# Altium project Complex_PCB.PrjPcb (part 2 of 3)

## Sheet Microcontroller.SchDoc
size A3; SheetNumber: 3; SheetTotal: 4
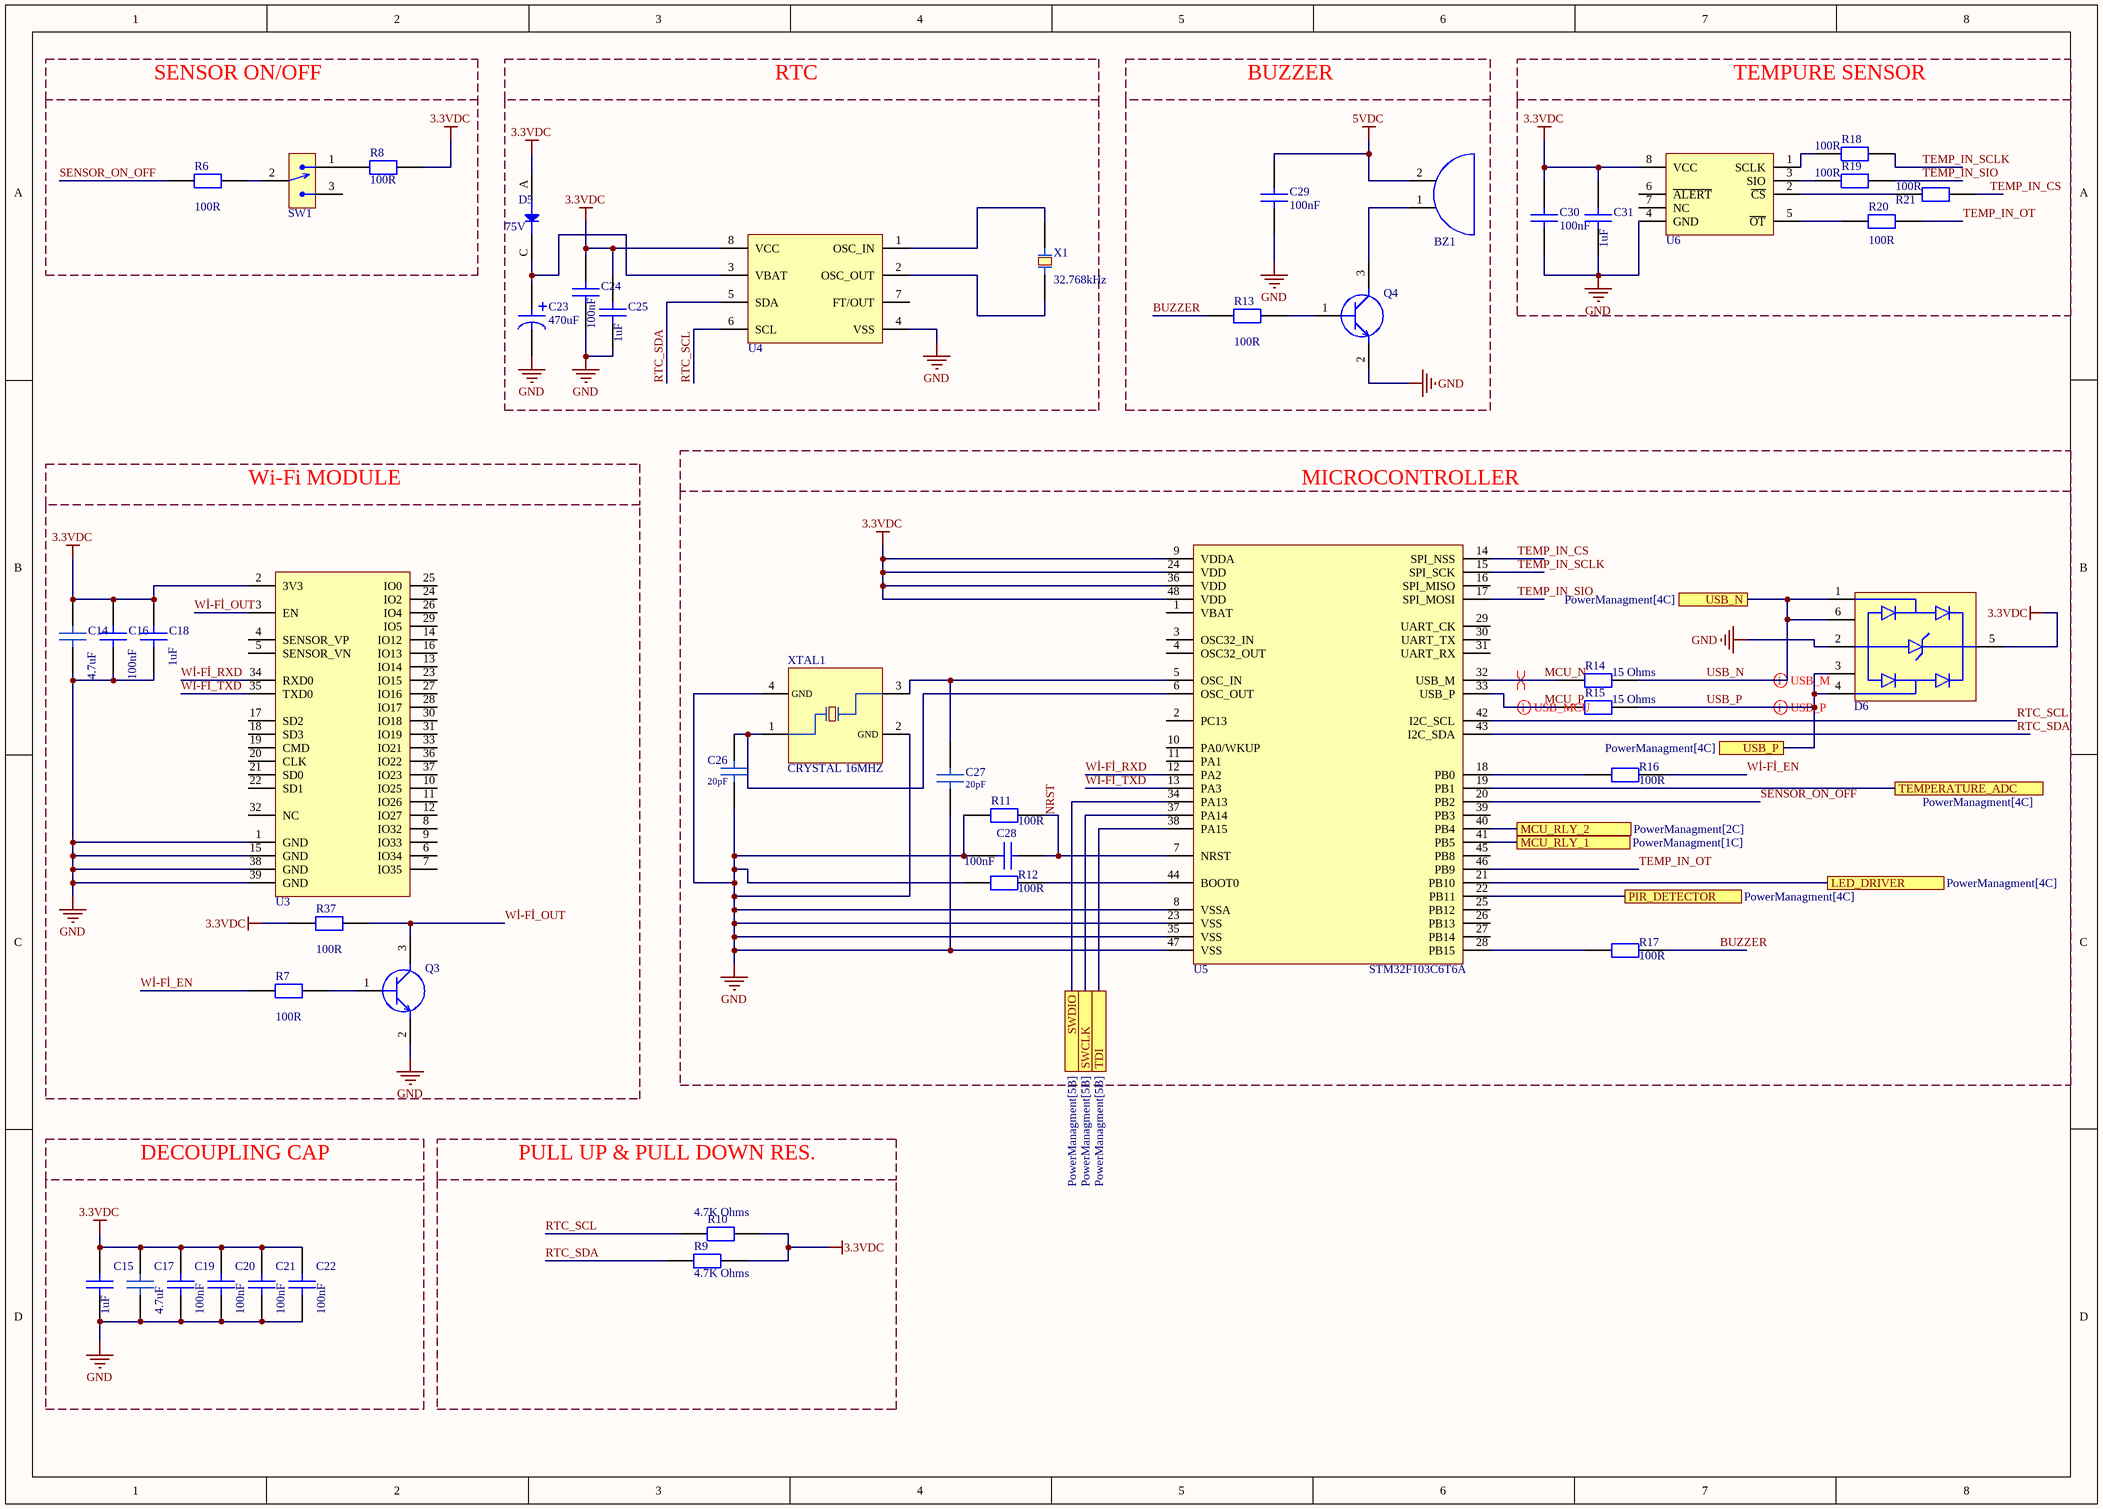
[diagram p2: Microcontroller.SchDoc]

### Parts
BZ1  CMI-9605-0580T  [BUZZER CMI-9605-0580T]  (value not drawn)
C14  value 4.7uF  [CAP 0805]  (hidden comment: CAP CER 4.7UF 25V X5R 0805)
C15  Capacitance: 1uF  [CAP 0805]  (hidden comment: CAP CER 1UF 50V X7R 0805)
C16  Capacitance: 100nF  [CAP 0603]  (hidden comment: CAP CER 100nF)
C17  value 4.7uF  [CAP 0805]  (hidden comment: CAP CER 4.7UF 25V X5R 0805)
C18  Capacitance: 1uF  [CAP 0805]  (hidden comment: CAP CER 1UF 50V X7R 0805)
C19  Capacitance: 100nF  [CAP 0603]  (hidden comment: CAP CER 100nF)
C20  Capacitance: 100nF  [CAP 0603]  (hidden comment: CAP CER 100nF)
C21  Capacitance: 100nF  [CAP 0603]  (hidden comment: CAP CER 100nF)
C22  Capacitance: 100nF  [CAP 0603]  (hidden comment: CAP CER 100nF)
C23  Capacitance: 470uF  [CAP _RADİAL_D10_P5]  (hidden comment: ESH477M050AH4AA CAP)
C24  value 100nF  [CAP 0805]  (hidden comment: CAP CER 0.1UF 50V X7R 0805)
C25  Capacitance: 1uF  [CAP 0805]  (hidden comment: CAP CER 1UF 50V X7R 0805)
C26  Capacitance: 20pF  [CAP 0603]  (hidden comment: CAP CER 20PF 50V C0G/NP0 0603)
C27  Capacitance: 20pF  [CAP 0603]  (hidden comment: CAP CER 20PF 50V C0G/NP0 0603)
C28  Capacitance: 100nF  [CAP 0603]  (hidden comment: CAP CER 100nF)
C29  value 100nF  [CAP 0805]  (hidden comment: CAP CER 0.1UF 50V X7R 0805)
C30  Capacitance: 100nF  [CAP 0603]  (hidden comment: CAP CER 100nF)
C31  Capacitance: 1uF  [CAP 0805]  (hidden comment: CAP CER 1UF 50V X7R 0805)
D5  Operating Voltage: 75V  [SOD323F]  (hidden comment: DIODE GEN PURP 75V 150MA SOD323F)
D6  TVS DIODE 5.25VWM 17VC SOT23-6  [SOT23-6L]  (value not drawn)
Q3  MMBT3904-7-F  [SOT23F]  (value not drawn)
Q4  MMBT3904-7-F  [SOT23F]  (value not drawn)
R6  Resistance: 100R  [RES 0603]  (hidden comment: RC0603JR-07100RL)
R7  Resistance: 100R  [RES 0603]  (hidden comment: RC0603JR-07100RL)
R8  Resistance: 100R  [RES 0603]  (hidden comment: RC0603JR-07100RL)
R9  Resistance: 4.7K Ohms  [RES 0603]  (hidden comment: RC0603JR-074K7L)
R10  Resistance: 4.7K Ohms  [RES 0603]  (hidden comment: RC0603JR-074K7L)
R11  Resistance: 100R  [RES 0603]  (hidden comment: RC0603JR-07100RL)
R12  Resistance: 100R  [RES 0603]  (hidden comment: RC0603JR-07100RL)
R13  Resistance: 100R  [RES 0603]  (hidden comment: RC0603JR-07100RL)
R14  Resistance: 15 Ohms  [RES 0603]  (hidden comment: RC0603JR-0715RL)
R15  Resistance: 15 Ohms  [RES 0603]  (hidden comment: RC0603JR-0715RL)
R16  Resistance: 100R  [RES 0603]  (hidden comment: RC0603JR-07100RL)
R17  Resistance: 100R  [RES 0603]  (hidden comment: RC0603JR-07100RL)
R18  Resistance: 100R  [RES 0603]  (hidden comment: RC0603JR-07100RL)
R19  Resistance: 100R  [RES 0603]  (hidden comment: RC0603JR-07100RL)
R20  Resistance: 100R  [RES 0603]  (hidden comment: RC0603JR-07100RL)
R21  Resistance: 100R  [RES 0603]  (hidden comment: RC0603JR-07100RL)
R37  Resistance: 100R  [RES 0603]  (hidden comment: RC0603JR-07100RL)
SW1  EG1215AA  [EG1215AA]  (value not drawn)
U3  ESP32-VROOM-32  [ESP-32-32E]  (value not drawn)
U4  M41T00M6F  [SOIC8]  (value not drawn)
U5  STM32F103C6T6A  [LQFP48]
U6  MAX6662MSA+  [SOIC8]  (value not drawn)
X1  Frequency: 32.768kHz  [ABS05]  (hidden comment: CRYSTAL 32.7680KHZ 12.5PF SMD)
XTAL1  CRYSTAL 16MHZ  [ECS-160-20-30B-TR]

### Blocks framed on the sheet
SENSOR ON/OFF: R6 R8 SW1
RTC: C23-C25 D5 U4 X1
BUZZER: BZ1 C29 Q4 R13
TEMPURE SENSOR: C30 C31 R18-R21 U6
MICROCONTROLLER: C26-C28 D6 R11 R12 R14-R17 U5 XTAL1
Wi-Fi MODULE: C14 C16 C18 Q3 R7 R37 U3
DECOUPLING CAP: C15 C17 C19-C22
PULL UP & PULL DOWN RES.: R9 R10

### Ports
LED_DRIVER (see PowerManagment[4C]), MCU_RLY_1 (see PowerManagment[1C]), MCU_RLY_2 (see PowerManagment[2C]), PIR_DETECTOR (see PowerManagment[4C]), SWCLK (see PowerManagment[5B]), SWDIO (see PowerManagment[5B]), TDI (see PowerManagment[5B]), TEMPERATURE_ADC (see PowerManagment[4C]), USB_N (see PowerManagment[4C]), USB_P (see PowerManagment[4C])

### Nets
3.3VDC: C14.2 C15.1 C16.2 C17.2 C18.1 C19.2 C20.2 C21.2 C22.2 C24.2 C25.1 C30.2 C31.1 D5.A(Anode) D6.5(VBUS) R8.2 R9.2 R10.2 R37.1 U3.2(3V3) U4.8(VCC) U5.9(VDDA) U5.24(VDD) U5.36(VDD) U5.48(VDD) U6.8(VCC)
5VDC: BZ1.2 C29.2
GND: C14.1 C15.2 C16.1 C17.1 C18.2 C19.1 C20.1 C21.1 C22.1 C23.2 C24.1 C25.2 C26.1 C27.1 C28.1 C29.1 C30.1 C31.2 D6.2(GND) Q3.2(EMİTTER) Q4.2(EMİTTER) R11.1 R12.1 U3.1(GND) U3.15(GND) U3.38(GND) U3.39(GND) U4.4(VSS) U5.8(VSSA) U5.23(VSS) U5.35(VSS) U5.47(VSS) U6.4(GND) XTAL1.2(GND) XTAL1.4(GND)
BUZZER: R13.1 R17.2
MCU_N: R14.2 U5.32(USB_M)
MCU_P: R15.2 U5.33(USB_P)
NRST: C28.2 R11.2 U5.7(NRST)
RTC_SCL: R10.1 U4.6(SCL) U5.42(I2C_SCL)
RTC_SDA: R9.1 U4.5(SDA) U5.43(I2C_SDA)
SENSOR_ON_OFF: R6.1 U5.20(PB2)
TEMP_IN_CS: R21.2 U5.14(SPI_NSS)
TEMP_IN_OT: R20.2 U5.46(PB9)
TEMP_IN_SCLK: R18.2 U5.15(SPI_SCK)
TEMP_IN_SIO: R19.2 U5.17(SPI_MOSI)
USB_N: D6.1(I/O1) D6.6(I/O1) R14.1 ; port USB_N
USB_P: D6.3(I/O2) D6.4(I/O2) R15.1 ; port USB_P
Wİ-Fİ_EN: R7.1 R16.2
Wİ-Fİ_OUT: Q3.3(CONNECTOR) R37.2 U3.3(EN)
Wİ-Fİ_RXD: U3.34(RXD0) U5.12(PA2)
Wİ-Fİ_TXD: U3.35(TXD0) U5.13(PA3)
NetBZ1_1: BZ1.1 Q4.3(CONNECTOR)
NetC23_1: C23.1 D5.C(Cathode) U4.3(VBAT)
NetC26_2: C26.2 U5.6(OSC_OUT) XTAL1.1(IN/OUT)
NetC27_2: C27.2 U5.5(OSC_IN) XTAL1.3(OUT/IN)
NetJ6_2: U5.21(PB10) ; port LED_DRIVER
NetJ6_3: U5.19(PB1) ; port TEMPERATURE_ADC
NetJ6_4: U5.22(PB11) ; port PIR_DETECTOR
NetJ7_2: U5.38(PA15) ; port TDI
NetJ7_3: U5.37(PA14) ; port SWCLK
NetJ7_4: U5.34(PA13) ; port SWDIO
NetQ3_1: Q3.1(BASE) R7.2
NetQ4_1: Q4.1(BASE) R13.2
NetR1_1: U5.41(PB5) ; port MCU_RLY_1
NetR4_1: U5.40(PB4) ; port MCU_RLY_2
NetR6_2: R6.2 SW1.2
NetR8_1: R8.1 SW1.1
NetR12_2: R12.2 U5.44(BOOT0)
NetR16_1: R16.1 U5.18(PB0)
NetR17_1: R17.1 U5.28(PB15)
NetR18_1: R18.1 U6.1(SCLK)
NetR19_1: R19.1 U6.3(SIO)
NetR20_1: R20.1 U6.5(~{OT})
NetR21_1: R21.1 U6.2(~{CS})
NetU4_1: U4.1(OSC_IN) X1.1
NetU4_2: U4.2(OSC_OUT) X1.2

Not connected (* = marked no-connect by the designer): SW1 3; U3 4(SENSOR_VP) 5(SENSOR_VN) 6(IO34) 7(IO35) 8(IO32) 9(IO33) 10(IO25) 11(IO26) 12(IO27) 13(IO14) 14(IO12) 16(IO13) 17(SD2) 18(SD3) 19(CMD) 20(CLK) 21(SD0) 22(SD1) 23(IO15) 24(IO2) 25(IO0) 26(IO4) 27(IO16) 28(IO17) 29(IO5) 30(IO18) 31(IO19) 32(NC) 33(IO21) 36(IO22) 37(IO23); U4 7(FT/OUT); U5 1(VBAT) 2(PC13) 3(OSC32_IN) 4(OSC32_OUT) 10(PA0/WKUP) 11(PA1) 16(SPI_MISO) 25(PB12) 26(PB13) 27(PB14) 29(UART_CK) 30(UART_TX) 31(UART_RX) 39(PB3) 45(PB8); U6 6(~{ALERT}) 7(NC)

### Layout directives
differential pair: MCU_N, MCU_P, USB_N, USB_P

### Library data of the parts
BZ1 = CMI-9605-0580T: 9.6 mm, 5 Vdc, 80 dB, Through Hole, Driving Circuit, Magnetic Audio Indicator Buzzer; Manufacturer: CUI Devices; Supply Voltage Nominal: 3 ~ 7V; Designed By: Görkem Bulut; Supplier: Digi-Key; Supplier Part Number: 102-CMI-9605-0580T-ND; Manufacturer Part Number: CMI-9605-0580T; RoHS: No; Operating Temperature: -30°C ~ 70°C; Case Package: CMI-9605IC
C14 C17 = CAP CER 4.7uF: Manufacturer: Samsung; Manufacturer Part Number: CL21A475KAQNNNE; Tolerance: 10%; Supplier: Digi-Key; Supplier Part Number: 1276-1244-1-ND; RoHS: Yes; Category: Ceramic Capacitors; Stock: 3937628; Pricing: 1=0,1, 10=0,073, 50=0,0414, 100=0,0344, 500=0,02408, 1000=0,01994 (USD); Mounting Technology: Surface Mount; Case/Package: 0805; Case Code (Metric): 2012; Case Code (Imperial): 0805; Min Operating Temperature: -55°C; Max Operating Temperature: 85°C; Packaging: Tape and Reel; Voltage Rating: 25V; Dielectric: X5R; Voltage Rating (DC): 25V; Series: CL; Construction: Flat; Length: 2mm; Height: 1.25mm; Depth: 1.25mm; Radiation Hardening: No; Lead Free: Lead Free; RoHS Compliant: Yes; ComponentLink1URL: https://datasheet.ciiva.com/25798/cl21a475kaqnnne-25798882.pdf?src-supplier=Digi-Key; ComponentLink1Description: https://datasheet.ciiva.com/25798/cl21a475kaqnnne-25798882.pdf?src-supplier=Digi-Key
C15 C18 C25 C31 = CAP CER 1uF: Manufacturer: Samsung; Manufacturer Part Number: CL21B105KBFNNNE; Designed By: Görkem Bulut; Supplier: Digi-Key; Supplier Part Number: 1276-1029-1-ND; RoHS: Yes; Category: Ceramic Capacitors; Stock: 142606; Pricing: 1=0,11, 10=0,079, 50=0,045, 100=0,0373, 500=0,02616, 1000=0,02165 (USD); ComponentLink1URL: https://datasheet.ciiva.com/16449/cl21b105kbfnnne-16449003.pdf?src-supplier=Future+Electronics; ComponentLink1Description: https://datasheet.ciiva.com/16449/cl21b105kbfnnne-16449003.pdf?src-supplier=Future+Electronics; ComponentLink2URL: https://datasheet.ciiva.com/25800/cl21b105kbfnnne-25800291.pdf?src-supplier=Digi-Key; ComponentLink2Description: https://datasheet.ciiva.com/25800/cl21b105kbfnnne-25800291.pdf?src-supplier=Digi-Key; Case Package: 0805
C16 C19-C22 C28 C30 = CAP CER 100nF: Cap Cer 0.1UF 16V X7R 0603 %10; Manufacturer: KEMET; Manufacturer Part Number: C0603C104K4RAC7082; Designed by: Görkem Bulut; Number of Pads: 2; Supplier: Digi-Key; Supplier Part Number: 399-C0603C104K4RAC7082CT-ND; RoHS: Yes; Category: Ceramic Capacitors; Stock: 34170; Pricing: 1=0,1, 10=0,072, 50=0,0394, 100=0,0322, 500=0,02298, 1000=0,01805, 2500=0,01641, 5000=0,0151 (USD); RoHS Compliant: Yes; Case Package: 0603
C23 = ESH477M050AH4AA CAP: Cap, 470UF, 50V, Alu Elec, Radial; Manufacturer: KEMET; Designed By: Görkem Bulut; Supplier: Digi-Key; Supplier Part Number: 399-15683-ND; Manufacturer Part Number: ESH477M050AH4AA; RoHS: Yes; Stock: 6719; Pricing: 1=0,68, 10=0,482, 50=0,3646, 100=0,3175, 500=0,23518, 1000=0,19991, 2500=0,18815, 5000=0,17639 (USD); ComponentLink1URL: https://api.kemet.com/component-edge/download/datasheet/ESH477M050AH4AA.pdf?src-supplier=Digi-Key; ComponentLink1Description: https://api.kemet.com/component-edge/download/datasheet/ESH477M050AH4AA.pdf?src-supplier=Digi-Key; ComponentLink2URL: https://datasheet.octopart.com/ESH477M050AH4AA-KEMET-datasheet-130075338.pdf?src-supplier=Newark; ComponentLink2Description: https://datasheet.octopart.com/ESH477M050AH4AA-KEMET-datasheet-130075338.pdf?src-supplier=Newark
C24 C29 = CAP CER 100nF 0805: Multilayer Ceramic Capacitor, 0.1 uF, 50 V, ± 10%, X7R, 0805 [2012 Metric]; Manufacturer: Samsung; Manufacturer Part Number: CL21B104KBCNNNC; Supplier: Digi-Key; Supplier Part Number: 1276-1003-1-ND; RoHS: Yes; Category: Ceramic Capacitors; Stock: 954560; Pricing: 1=0,1, 10=0,044, 50=0,024, 100=0,0196, 500=0,01404, 1000=0,01103 (USD); Mounting Technology: Surface Mount; Case/Package: 0805; Case Code (Metric): 2012; Case Code (Imperial): 0805; Material: Ceramic; Min Operating Temperature: -55°C; Max Operating Temperature: 125°C; Tolerance: 10%; Dielectric: X7R; Packaging: Tape and Reel; Voltage Rating: 50V; Voltage: 50V; Voltage Rating (DC): 50V; Series: CL; Construction: Flat; Length: 2mm; Width: 0.049inch; Height: 0.85mm; Depth: 1.25mm; Thickness: 0.037inch; Radiation Hardening: No; Lead Free: Lead Free; RoHS Compliant: Yes; ComponentLink1URL: https://datasheet.ciiva.com/25710/cl21b104kbcnnnc-25710182.pdf?src-supplier=Digi-Key; ComponentLink1Description: https://datasheet.ciiva.com/25710/cl21b104kbcnnnc-25710182.pdf?src-supplier=Digi-Key; ComponentLink2URL: https://datasheet.ciiva.com/29199/454152-da-01-en-vs-kondensator-0805-29199814.pdf?src-supplier=Conrad; ComponentLink2Description: https://datasheet.ciiva.com/29199/454152-da-01-en-vs-kondensator-0805-29199814.pdf?src-supplier=Conrad
C26 C27 = CAP CER 20pF: Manufacturer: Samsung; Manufacturer Part Number: CL10C200JB8NNNC; Supplier: Digi-Key; Supplier Part Number: 1276-1187-1-ND; RoHS: Yes; Category: Ceramic Capacitors; Stock: 417304; Pricing: 1=0,1, 10=0,044, 50=0,0238, 100=0,0194, 500=0,01386, 1000=0,01089 (USD); ComponentLink1URL: https://datasheet.ciiva.com/26877/getdatasheetpartid-640634-26877974.pdf?src-supplier=Verical; ComponentLink1Description: https://datasheet.ciiva.com/26877/getdatasheetpartid-640634-26877974.pdf?src-supplier=Verical; ComponentLink2URL: https://datasheet.ciiva.com/26310/mlcc-catalogdownload2013-eng-26310315.pdf?src-supplier=Distrelec; ComponentLink2Description: https://datasheet.ciiva.com/26310/mlcc-catalogdownload2013-eng-26310315.pdf?src-supplier=Distrelec; Case/Package: 0603
D5 = 1N4148WS: VR=75V IF=150mA Trr=4ns P=200mW; Manufacturer: ON Semiconductor / Fairchild; Designed By: Görkem Bulut; Supplier: Digi-Key; Supplier Part Number: 1N4148WSFSCT-ND; Manufacturer Part Number: 1N4148WS; RoHS: Yes; Category: Rectifier Diodes; Stock: 1572050; Pricing: 1=0,18, 10=0,169, 100=0,0918, 500=0,0565, 1000=0,03852 (USD); ComponentLink1URL: https://datasheet.ciiva.com/15208/getdatasheetpartid-127819-15208358.pdf?src-supplier=Verical; ComponentLink1Description: https://datasheet.ciiva.com/15208/getdatasheetpartid-127819-15208358.pdf?src-supplier=Verical; Case Package: SOD323F; Operatşng Current: 150mA
D6 = USBLC6-2SC6: Manufacturer: STMicroelectronics; Designed By: Görkem Bulut; Supplier: Digi-Key; Supplier Part Number: 497-5235-1-ND; Manufacturer Part Number: USBLC6-2SC6; RoHS: Yes; Category: TVS Diodes; Stock: 135257; Pricing: 1=0,6, 10=0,512, 100=0,3823, 500=0,30042, 1000=0,23214 (USD); ComponentLink1URL: https://datasheet.ciiva.com/15143/getdatasheetpartid-148465-15143789.pdf?src-supplier=Verical; ComponentLink1Description: https://datasheet.ciiva.com/15143/getdatasheetpartid-148465-15143789.pdf?src-supplier=Verical; ComponentLink2URL: https://datasheet.ciiva.com/1268/1690354-1268384.pdf?src-supplier=Element14; ComponentLink2Description: https://datasheet.ciiva.com/1268/1690354-1268384.pdf?src-supplier=Element14; ComponentLink3URL: https://datasheet.ciiva.com/4508/cd00050750-113117-4508433.pdf?src-supplier=Mouser; ComponentLink3Description: https://datasheet.ciiva.com/4508/cd00050750-113117-4508433.pdf?src-supplier=Mouser; ComponentLink4URL: https://datasheet.ciiva.com/16200/cd00050750-16200026.pdf?src-supplier=Future+Electronics; ComponentLink4Description: https://datasheet.ciiva.com/16200/cd00050750-16200026.pdf?src-supplier=Future+Electronics; ComponentLink5URL: https://datasheet.ciiva.com/41444/001184109-da-01-en-ic-esd-protecti-usblc6-2sc6-sot-23-6-stm-41444156.pdf?src-supplier=Conrad; ComponentLink5Description: https://datasheet.ciiva.com/41444/001184109-da-01-en-ic-esd-protecti-usblc6-2sc6-sot-23-6-stm-41444156.pdf?src-supplier=Conrad; Case Package: SOT23-6L
Q3 Q4 = MMBT3904-7-F: Transistor General Purpose BJT NPN 40 Volt 0.2A Automotive 3-Pin SOT-23; Manufacturer: Diodes Zetex; Designed by: Gökem Bulut; Max Power Dissipation: 300mW; Collector Emitter Voltage (VCEO): 40V; Max Collector Current: 200mA; Collector Base Voltage (VCBO): 60V; Power Dissipation: 350mW; Frequency: 300MHz; hFE Min: 100; Number of Elements: 1; Emitter Base Voltage (VEBO): 6V; Collector Emitter Saturation Voltage: 300mV; Supplier: Digi-Key; Supplier Part Number: MMBT3904-FDICT-ND; Manufacturer Part Number: MMBT3904-7-F; RoHS: Yes; Category: BJTs; Stock: 6151063; Pricing: 1=0,12, 10=0,111, 100=0,0607, 500=0,03732, 1000=0,02545 (USD); Mounting Technology: Surface Mount; Case/Package: SOT-23; Pins: 3; Weight: 0.000282oz; Min Operating Temperature: -55°C; Max Operating Temperature: 150°C; Polarity: NPN; Packaging: Tape and Reel; Package Quantity: 3000; Transition Frequency: 300MHz; Collector Emitter Breakdown Voltage: 40V; Max Breakdown Voltage: 40V; Continuous Collector Current: 200mA; Clock Frequency: 300MHz; Gain Bandwidth Product: 300MHz; Voltage Rating (DC): 40V; Series: Automotive, AEC-Q101; Collector-emitter Voltage-Max: 300mV; Length: 3.05mm; Width: 1.4mm; Height: 1mm; Radiation Hardening: No; Reach SVHC Compliant: No; Lead Free: Lead Free; RoHS Compliant: Yes; ComponentLink1URL: https://datasheet.ciiva.com/11201/ds30036-11201778.pdf?src-supplier=Avnet; ComponentLink1Description: https://datasheet.ciiva.com/11201/ds30036-11201778.pdf?src-supplier=Avnet; ComponentLink2URL: https://datasheet.ciiva.com/15138/getdatasheetpartid-53265-15138780.pdf?src-supplier=Verical; ComponentLink2Description: https://datasheet.ciiva.com/15138/getdatasheetpartid-53265-15138780.pdf?src-supplier=Verical; ComponentLink3URL: https://datasheet.ciiva.com/22711/1915516-22711750.pdf?src-supplier=Element14; ComponentLink3Description: https://datasheet.ciiva.com/22711/1915516-22711750.pdf?src-supplier=Element14; ComponentLink4URL: https://datasheet.ciiva.com/11198/ds30036-11198999.pdf?src-supplier=Avnet; ComponentLink4Description: https://datasheet.ciiva.com/11198/ds30036-11198999.pdf?src-supplier=Avnet; ComponentLink5URL: https://datasheet.ciiva.com/6361/ds30036-6361256.pdf?src-supplier=Digi-Key; ComponentLink5Description: https://datasheet.ciiva.com/6361/ds30036-6361256.pdf?src-supplier=Digi-Key; ComponentLink6URL: https://datasheet.ciiva.com/6361/ds30036-6361254.pdf?src-supplier=Digi-Key; ComponentLink6Description: https://datasheet.ciiva.com/6361/ds30036-6361254.pdf?src-supplier=Digi-Key
R6-R8 R11-R13 R16-R21 R37 = RES 100 OHM: Res Thick Film 0603 100 Ohm 5% 1/10W ±100ppm/°C Molded SMD SMD Paper T/R; Manufacturer: Yageo; Voltage Rating (DC): 50V; Power Rating: 100mW; Designed By: G.B; Supplier: Digi-Key; Supplier Part Number: 311-100GRCT-ND; Manufacturer Part Number: RC0603JR-07100RL; RoHS: Yes; Category: Chip SMD Resistors; Stock: 983038; Pricing: 1=0,1, 10=0,014, 50=0,0088, 100=0,0073, 500=0,00486, 1000=0,00415 (USD); Case/Package: 0603; Pins: 2; Contact Plating: Tin,Matte; Case Code (Imperial): 0603; Case Code (Metric): 1608; Min Operating Temperature: -55°C; Max Operating Temperature: 155°C; Tolerance: 5%; Temperature Coefficient: 100ppm/°C; Resistor Type: Thick Film; Packaging: Tape and Reel; Voltage Rating: 50V; Termination: SMD/SMT; Features: Moisture Resistant; Series: RC; Max Power Dissipation: 100mW; Number of Terminations: 2; Construction: Rectangular; Resistance Tolerance: 5%; Length: 1.6mm; Width: 0.8mm; Depth: 0.8mm; Lead Free: Lead Free; Reach SVHC Compliant: Unknown; Military Standard: Not; RoHS Compliant: Yes; ComponentLink1URL: https://datasheet.ciiva.com/7746/443971-7746425.pdf?src-supplier=Element14; ComponentLink1Description: https://datasheet.ciiva.com/7746/443971-7746425.pdf?src-supplier=Element14; ComponentLink2URL: https://datasheet.ciiva.com/7746/443971-7746426.pdf?src-supplier=Element14; ComponentLink2Description: https://datasheet.ciiva.com/7746/443971-7746426.pdf?src-supplier=Element14; ComponentLink3URL: https://datasheet.ciiva.com/8883/pyu-rc0603-51-rohs-l-4-8883047.pdf?src-supplier=Avnet; ComponentLink3Description: https://datasheet.ciiva.com/8883/pyu-rc0603-51-rohs-l-4-8883047.pdf?src-supplier=Avnet; ComponentLink4URL: https://datasheet.ciiva.com/15189/getdatasheetpartid-325207-15189846.pdf?src-supplier=Verical; ComponentLink4Description: https://datasheet.ciiva.com/15189/getdatasheetpartid-325207-15189846.pdf?src-supplier=Verical
R9 R10 = RES 4K7 OHM: Res General Purpose Thick Film 0603 4.7k Ohm 5% 1/10W ±100ppm/°C Molded Paper T/R; Manufacturer: Yageo; Case Pakcage: 0603; Designed By: Görkem Bulut; Supplier: Digi-Key; Supplier Part Number: 311-4.7KGRCT-ND; Manufacturer Part Number: RC0603JR-074K7L; RoHS: Yes; Category: Chip SMD Resistors; Stock: 7163965; Pricing: 1=0,1, 10=0,014, 50=0,0088, 100=0,0073, 500=0,00486, 1000=0,00415 (USD); ComponentLink1URL: https://datasheet.ciiva.com/46412/443971-46412858.pdf?src-supplier=Element14; ComponentLink1Description: https://datasheet.ciiva.com/46412/443971-46412858.pdf?src-supplier=Element14
R14 R15 = RES 15 OHM: Res Thick Film 0603 15 Ohm 5% 0.1W(1/10W) ±100ppm/C Pad SMD T/R; Manufacturer: Yageo; Designed By: Görkem Bulut; Supplier: Digi-Key; Supplier Part Number: 311-15GRCT-ND; Manufacturer Part Number: RC0603JR-0715RL; RoHS: Yes; Category: Chip SMD Resistors; Stock: 976030; Pricing: 1=0,1, 10=0,014, 50=0,0088, 100=0,0073, 500=0,00486, 1000=0,00415 (USD); ComponentLink1URL: https://datasheet.ciiva.com/2453/pyu-r-int-thick-7-2453085.pdf?src-supplier=Digi-Key; ComponentLink1Description: https://datasheet.ciiva.com/2453/pyu-r-int-thick-7-2453085.pdf?src-supplier=Digi-Key; ComponentLink2URL: https://datasheet.ciiva.com/2453/pyu-r-int-thick-7-2453086.pdf?src-supplier=Digi-Key; ComponentLink2Description: https://datasheet.ciiva.com/2453/pyu-r-int-thick-7-2453086.pdf?src-supplier=Digi-Key; ComponentLink3URL: https://datasheet.ciiva.com/2453/pyu-r-int-thick-7-2453087.pdf?src-supplier=Digi-Key; ComponentLink3Description: https://datasheet.ciiva.com/2453/pyu-r-int-thick-7-2453087.pdf?src-supplier=Digi-Key; ComponentLink4URL: https://datasheet.ciiva.com/7746/443971-7746445.pdf?src-supplier=Element14; ComponentLink4Description: https://datasheet.ciiva.com/7746/443971-7746445.pdf?src-supplier=Element14; ComponentLink5URL: https://datasheet.ciiva.com/7746/443971-7746446.pdf?src-supplier=Element14; ComponentLink5Description: https://datasheet.ciiva.com/7746/443971-7746446.pdf?src-supplier=Element14; Case Package: 0603
SW1 = EG1215AA: Slide Switch, SPDT, 0.025A, 24V, SMD; Manufacturer: E-Switch; Mechanical Life: 10000Cycles; Switch Function: On-On; Actuator Type: Standard; Switch Travel: 1.5mm; Operating Force: 150gf; Actuator Length: 1.4mm; Designed by: Görkem Bulut; Supplier: Digi-Key; Supplier Part Number: EG5720CT-ND; Manufacturer Part Number: EG1215AA; RoHS: Yes; Stock: 8129; Pricing: 1=0,99, 10=0,951, 25=0,8884, 100=0,7715, 250=0,702, 500=0,6508, 1000=0,60327 (USD); Mounting Technology: Surface Mount; Min Operating Temperature: -20°C; Max Operating Temperature: 70°C; Throw Configuration: SPDT; Packaging: Cut Tape; Voltage Rating (DC): 24V; Termination: Gull Wing; Electrical Life: 10000Cycles; Series: EG; RoHS Compliant: Yes; ComponentLink1URL: https://media.digikey.com/pdf/Data%20Sheets/E-Switch%20PDFs/EG1215_Series_Ds.pdf?src-supplier=Digi-Key; ComponentLink1Description: https://media.digikey.com/pdf/Data%20Sheets/E-Switch%20PDFs/EG1215_Series_Ds.pdf?src-supplier=Digi-Key; ComponentLink2URL: http://www.farnell.com/datasheets/2645007.pdf?src-supplier=Farnell; ComponentLink2Description: http://www.farnell.com/datasheets/2645007.pdf?src-supplier=Farnell
U3 = ESP32-VROOM-32: Bluetooth, WiFi 802.11b/g/n, Bluetooth v4.2 + EDR, Class 1, 2 and 3 Transceiver Module 2.412GHz ~ 2.484GHz Integrated, Trace Surface Mount; Manufacturer Part Number: ESP32-WROOM-32E(4MB); Manufacturer: Espressif Systems; Designed by: Görkem Bulut; Supply Voltage Nominal: 3V3; ComponentLink1Description: DataSheet; ComponentLink1URL: https://www.espressif.com/sites/default/files/documentation/esp32-wroom-32e_esp32-wroom-32ue_datasheet_en.pdf; Category: RF Receivers, Transceivers
U4 = M41T00M6F: Real-time Clocks Clock/Calendar I2C, 2-Wire Serial 70uA @ 2V ~ 5.5V SOIC-8_150mil RoHS; Manufacturer: STMicroelectronics; Designed by: Görkem Bulut; Supplier: Digi-Key; Supplier Part Number: 497-4697-1-ND; Manufacturer Part Number: M41T00M6F; RoHS: Yes; Category: Real Time Clocks; Stock: 5504; Pricing: 1=3,96, 10=3,556, 25=3,3616, 100=2,9134, 250=2,76404, 500=2,48016, 1000=2,11425 (USD); ComponentLink1URL: https://datasheet.ciiva.com/7630/1837112-7630077.pdf?src-supplier=Element14; ComponentLink1Description: https://datasheet.ciiva.com/7630/1837112-7630077.pdf?src-supplier=Element14; ComponentLink2URL: https://datasheet.ciiva.com/16213/cd00001542-16213654.pdf?src-supplier=Future+Electronics; ComponentLink2Description: https://datasheet.ciiva.com/16213/cd00001542-16213654.pdf?src-supplier=Future+Electronics; ComponentLink3URL: https://datasheet.ciiva.com/41459/001185345-da-01-en-ic-rtc-srl-512kbit-m41t00m6f-soic-8-stm-41459818.pdf?src-supplier=Conrad; ComponentLink3Description: https://datasheet.ciiva.com/41459/001185345-da-01-en-ic-rtc-srl-512kbit-m41t00m6f-soic-8-stm-41459818.pdf?src-supplier=Conrad; Interface: I2C; Supply Voltage Nominal: 2V ~ 5.5V; Mounting Type: Surface Mount; Case Package: SOIC; Number of pins: 8
U5 = STM32F103C6T6A: MCU 32-bit STM32F ARM Cortex M3 RISC 32KB Flash 2.5V/3.3V 48-Pin LQFP Tray; Manufacturer: STMicroelectronics; Designed by: Görkem BULUT; Supplier: Digi-Key; Supplier Part Number: 497-11515-ND; Manufacturer Part Number: STM32F103C6T6A; RoHS: Yes; Category: Microcontrollers; Stock: 266; Pricing: 1=6,31, 10=5,669, 25=5,3592, 80=4,64475, 250=4,40656, 500=3,954, 1000=3,40275 (USD); ComponentLink1URL: https://datasheet.ciiva.com/15122/getdatasheetpartid-69879-15122075.pdf?src-supplier=Verical; ComponentLink1Description: https://datasheet.ciiva.com/15122/getdatasheetpartid-69879-15122075.pdf?src-supplier=Verical; ComponentLink2URL: https://datasheet.ciiva.com/14100/pustm-arm-microcont-stm32f103-en-14100507.pdf?src-supplier=Distrelec; ComponentLink2Description: https://datasheet.ciiva.com/14100/pustm-arm-microcont-stm32f103-en-14100507.pdf?src-supplier=Distrelec; Supplier 1: Mouser; Supplier Part Number 1: 511-STM32F103C6T6A; Case Package: LQFP48; Number of Pins: 48
U6 = MAX6662MSA+: Temp Sensor Digital Serial (3-Wire, SPI) 8-Pin SOIC N Tube; Manufacturer: Maxim; Designed By: Görkem Bulut; Supplier: Digi-Key; Supplier Part Number: MAX6662MSA+-ND; Manufacturer Part Number: MAX6662MSA+; RoHS: Yes; Category: Temperature and Humidity Sensors; Stock: 593; Pricing: 1=4,61, 10=3,457, 25=3,0732, 50=2,9196, 100=2,8428, 500=2,38178, 1000=2,22812 (USD); ComponentLink1URL: https://datasheet.ciiva.com/5299/max6662-89142-5299456.pdf?src-supplier=Mouser; ComponentLink1Description: https://datasheet.ciiva.com/5299/max6662-89142-5299456.pdf?src-supplier=Mouser; ComponentLink2URL: https://datasheet.ciiva.com/3277/max6662-3277979.pdf?src-supplier=Avnet; ComponentLink2Description: https://datasheet.ciiva.com/3277/max6662-3277979.pdf?src-supplier=Avnet; ComponentLink3URL: https://datasheet.ciiva.com/2003/max6662-2003390.pdf?src-supplier=Digi-Key; ComponentLink3Description: https://datasheet.ciiva.com/2003/max6662-2003390.pdf?src-supplier=Digi-Key; Case Package: SOIC-8; Number Of Pins: 8
X1 = CRYSTAL OSC 32.768 kHz: CRYSTAL 32.768kHz ±20ppm Crystal 12.5pF 90 kOhm -40°C ^ 85°C Surface Mount 2-SMD; Manufacturer: Abracon; Manufacturer Part Number: ABS05-32.768KHZ-T; ESR (Equivalent Series Resistance): 90kR; Supplier: Digi-Key; Supplier Part Number: 535-11899-1-ND; RoHS: Yes; Category: Crystals; Stock: 311064; Pricing: 1=0,72, 10=0,603, 50=0,5426, 100=0,4823, 500=0,4582, 1000=0,38586 (USD); Mounting Technology: Surface Mount; Case/Package: CSMD; Pins: 2; Min Operating Temperature: -40°C; Max Operating Temperature: 85°C; Packaging: Tape and Reel; Frequency Tolerance: 20ppm; Package Quantity: 3000; Tolerance: 20ppm; Termination: SMD/SMT; ESR: 90kR; Series: ABS05; Operating Frequency: 32.768 kHz; Length: 1.6mm; Width: 1mm; Height: 0.5mm; Depth: 1mm; Radiation Hardening: No; Reach SVHC Compliant: No; Lead Free: Lead Free; RoHS Compliant: Yes; ComponentLink1URL: https://datasheet.ciiva.com/23810/abs05-23810480.pdf?src-supplier=Newark; ComponentLink1Description: https://datasheet.ciiva.com/23810/abs05-23810480.pdf?src-supplier=Newark; ComponentLink2URL: https://datasheet.ciiva.com/6728/abs05-6728949.pdf?src-supplier=Digi-Key; ComponentLink2Description: https://datasheet.ciiva.com/6728/abs05-6728949.pdf?src-supplier=Digi-Key; ComponentLink3URL: https://datasheet.ciiva.com/6728/abs05-6728950.pdf?src-supplier=Digi-Key; ComponentLink3Description: https://datasheet.ciiva.com/6728/abs05-6728950.pdf?src-supplier=Digi-Key; ComponentLink4URL: https://datasheet.ciiva.com/16411/abs05-16411149.pdf?src-supplier=Future+Electronics; ComponentLink4Description: https://datasheet.ciiva.com/16411/abs05-16411149.pdf?src-supplier=Future+Electronics; Load Capacitance: 12.5pF
XTAL1 = CRYSTAL 16MHZ: Crystal 16MHz ±30ppm (Tol) ±50ppm (Stability) 20pF FUND 50Ohm 4-Pin Mini-SMD T/R; Manufacturer: ECS International; Designed by: Görkem B.; Supplier: Digi-Key; Supplier Part Number: XC1120CT-ND; Manufacturer Part Number: ECS-160-20-30B-TR; RoHS: Yes; Category: Crystals; Stock: 28924; Pricing: 1=0,75, 10=0,628, 50=0,5648, 100=0,5021, 500=0,47702 (USD); ComponentLink1URL: https://datasheet.ciiva.com/853/ecx-53b-853408.pdf?src-supplier=Digi-Key; ComponentLink1Description: https://datasheet.ciiva.com/853/ecx-53b-853408.pdf?src-supplier=Digi-Key; ComponentLink2URL: https://datasheet.ciiva.com/853/ecx-53b-853407.pdf?src-supplier=Digi-Key; ComponentLink2Description: https://datasheet.ciiva.com/853/ecx-53b-853407.pdf?src-supplier=Digi-Key; ComponentLink3URL: https://datasheet.ciiva.com/853/ecx-53b-853406.pdf?src-supplier=Digi-Key; ComponentLink3Description: https://datasheet.ciiva.com/853/ecx-53b-853406.pdf?src-supplier=Digi-Key; Load Capacitance: 20pF